# Altium project Delaytuning.PrjPcb
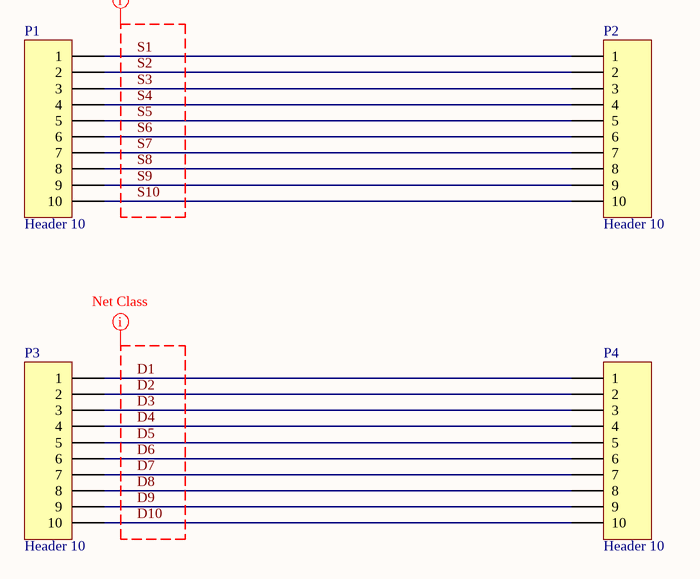
[diagram p0: Delaytuning.SchDoc]
1 sheet, 4 parts. Net scope: global (net labels, ports and power ports of the same name join across sheets).
Board file: Delaytuning.PcbDoc

## Sheet Delaytuning.SchDoc
size A4; SheetNumber: 1; SheetTotal: 1

### Parts
P1  Header 10  [HDR1X10]
P2  Header 10  [HDR1X10]
P3  Header 10  [HDR1X10]
P4  Header 10  [HDR1X10]

### Nets
D1: P3.1 P4.1
D2: P3.2 P4.2
D3: P3.3 P4.3
D4: P3.4 P4.4
D5: P3.5 P4.5
D6: P3.6 P4.6
D7: P3.7 P4.7
D8: P3.8 P4.8
D9: P3.9 P4.9
D10: P3.10 P4.10
S1: P1.1 P2.1
S2: P1.2 P2.2
S3: P1.3 P2.3
S4: P1.4 P2.4
S5: P1.5 P2.5
S6: P1.6 P2.6
S7: P1.7 P2.7
S8: P1.8 P2.8
S9: P1.9 P2.9
S10: P1.10 P2.10

### Layout directives
net class Signal: S1, S2, S3, S4, S5, S6, S7, S8, S9, S10
net class Data: D1, D2, D3, D4, D5, D6, D7, D8, D9, D10

### Library data of the parts
P1-P4 = Header 10: Header, 10-Pin; LatestRevisionDate: 17-Jul-2002; LatestRevisionNote: Re-released for DXP Platform.; Publisher: Altium Limited